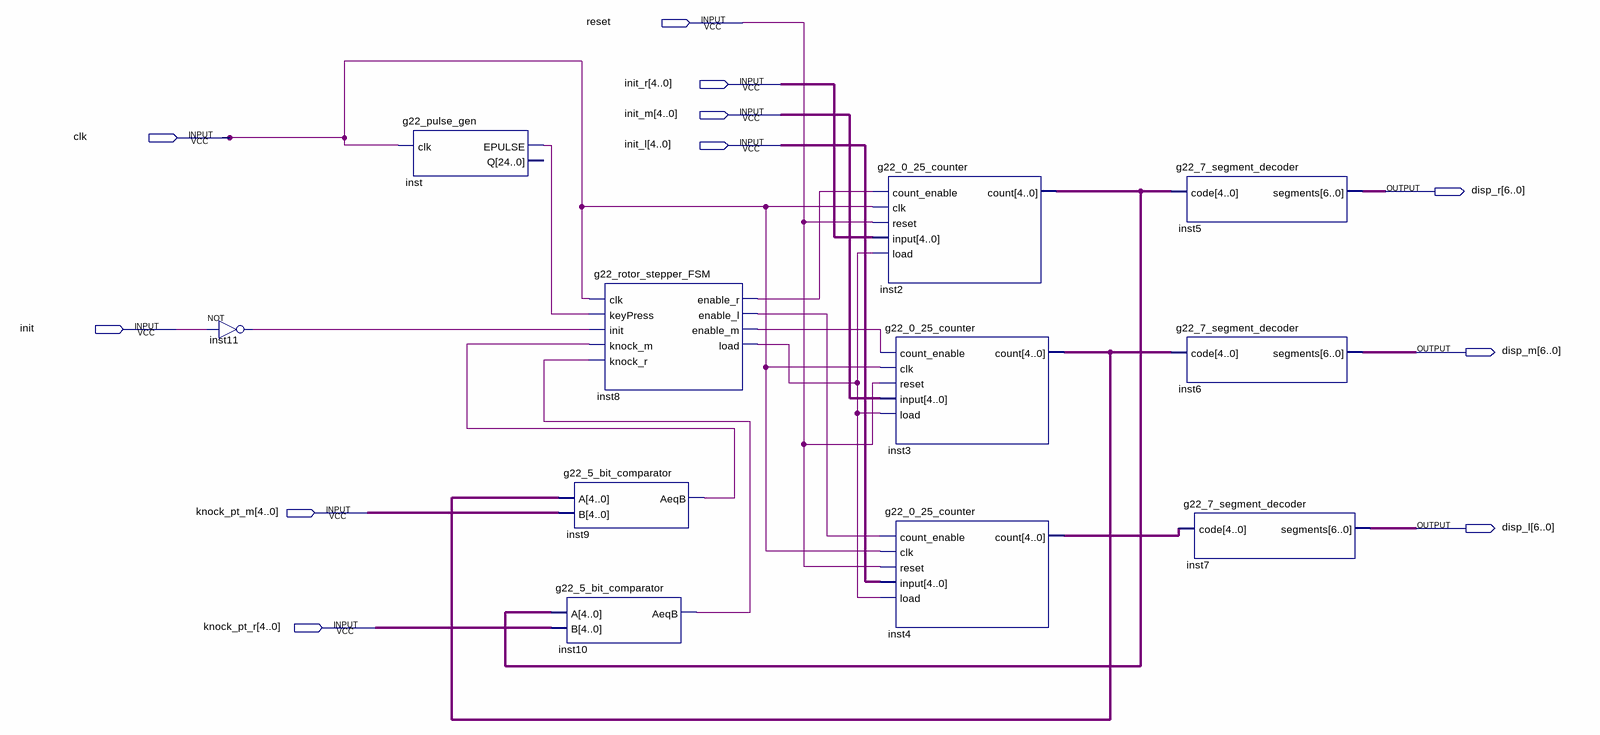
[diagram p0: schematic sheet]
// Quartus schematic g22_FSM_test_bed.bdf as structural Verilog: 11 symbols, 11 pins
module g22_FSM_test_bed (
  input  reset,
  input  [4:0] init_r,
  input  [4:0] init_m,
  input  clk,
  input  [4:0] init_l,
  input  init,
  input  [4:0] knock_pt_m,
  input  [4:0] knock_pt_r,
  output [6:0] disp_r,
  output [6:0] disp_m,
  output [6:0] disp_l
);

  wire inst8_enable_l, inst8_enable_m, inst8_enable_r, inst8_load, inst9_aeqb, inst10_aeqb, inst11_out,
       inst_epulse;
  wire [4:0] inst2_count, inst3_count, inst4_count;

  not inst11 (inst11_out, init);
  g22_pulse_gen inst (.clk(clk), .EPULSE(inst_epulse));  // open: Q
  g22_5_bit_comparator inst9 (.A(inst3_count), .B(knock_pt_m), .AeqB(inst9_aeqb));
  g22_5_bit_comparator inst10 (.A(inst2_count), .B(knock_pt_r), .AeqB(inst10_aeqb));
  g22_rotor_stepper_FSM inst8 (
    .clk(clk), .keyPress(inst_epulse), .init(inst11_out), .knock_m(inst9_aeqb), .knock_r(inst10_aeqb),
    .enable_r(inst8_enable_r), .enable_l(inst8_enable_l), .enable_m(inst8_enable_m), .load(inst8_load));
  g22_0_25_counter inst2 (
    .count_enable(inst8_enable_r), .clk(clk), .reset(reset), .\input (init_r), .load(inst8_load),
    .count(inst2_count));
  g22_0_25_counter inst3 (
    .count_enable(inst8_enable_m), .clk(clk), .reset(reset), .\input (init_m), .load(inst8_load),
    .count(inst3_count));
  g22_0_25_counter inst4 (
    .count_enable(inst8_enable_l), .clk(clk), .reset(reset), .\input (init_l), .load(inst8_load),
    .count(inst4_count));
  g22_7_segment_decoder inst5 (.code(inst2_count), .segments(disp_r));
  g22_7_segment_decoder inst6 (.code(inst3_count), .segments(disp_m));
  g22_7_segment_decoder inst7 (.code(inst4_count), .segments(disp_l));
endmodule
